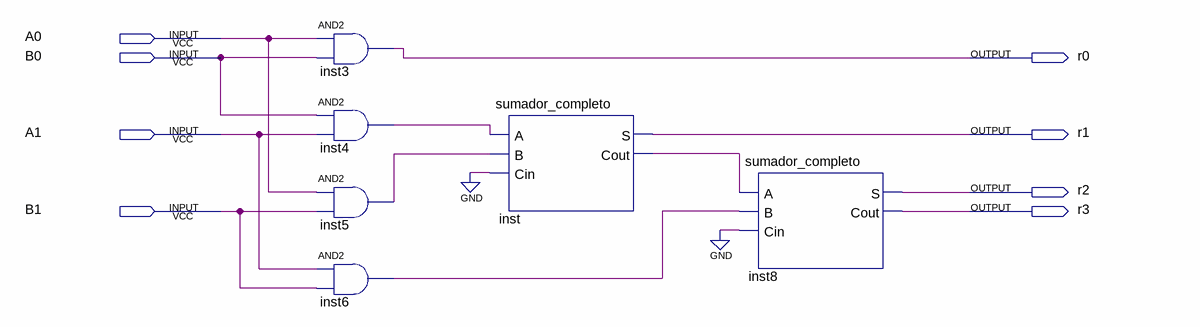
[diagram p0: schematic sheet]
// Quartus schematic multi_2b_cs.bdf as structural Verilog: 6 symbols, 8 pins
module multi_2b_cs (
  input  A0,
  input  B0,
  input  A1,
  input  B1,
  output r0,
  output r1,
  output r2,
  output r3
);

  wire inst4_out, inst5_out, inst6_out, inst_cout;

  and inst3 (r0, A0, B0);
  and inst4 (inst4_out, B0, A1);
  and inst5 (inst5_out, A0, B1);
  and inst6 (inst6_out, A1, B1);
  sumador_completo inst (.A(inst4_out), .B(inst5_out), .Cin(1'b0), .S(r1), .Cout(inst_cout));
  sumador_completo inst8 (.A(inst_cout), .B(inst6_out), .Cin(1'b0), .S(r2), .Cout(r3));
endmodule
